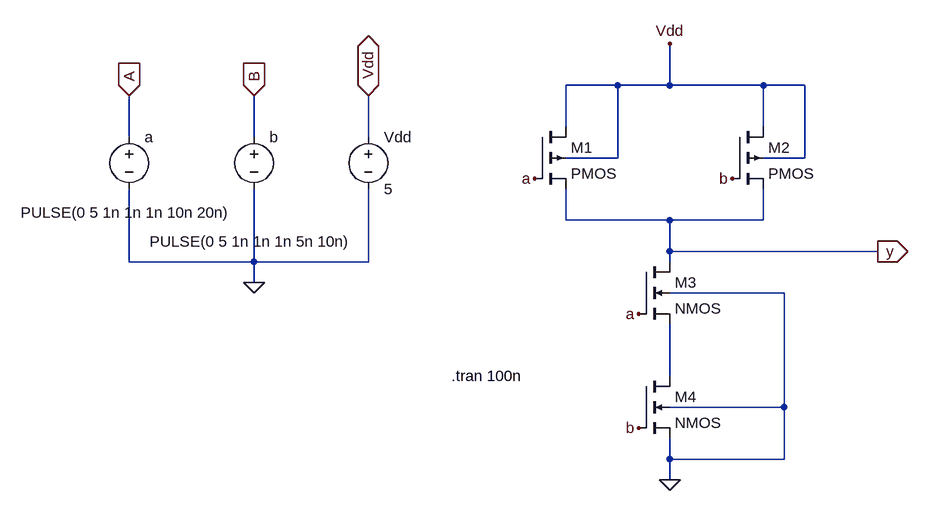
[diagram p0: schematic NAND.asc]
NAND.asc, the LTspice schematic file:
Version 4
SHEET 1 880 768
WIRE 368 144 288 144
WIRE 448 144 448 80
WIRE 448 144 368 144
WIRE 592 144 448 144
WIRE 656 144 592 144
WIRE 288 208 288 144
WIRE 592 208 592 144
WIRE -384 224 -384 160
WIRE -192 224 -192 160
WIRE -16 224 -16 160
WIRE 368 256 368 144
WIRE 368 256 288 256
WIRE 656 256 656 144
WIRE 656 256 592 256
WIRE 288 352 288 304
WIRE 448 352 288 352
WIRE 592 352 592 304
WIRE 592 352 448 352
WIRE 448 400 448 352
WIRE 768 400 448 400
WIRE -384 416 -384 304
WIRE -192 416 -192 304
WIRE -192 416 -384 416
WIRE -16 416 -16 304
WIRE -16 416 -192 416
WIRE 448 416 448 400
WIRE -192 448 -192 416
WIRE 624 464 448 464
WIRE 448 592 448 512
WIRE 624 640 624 464
WIRE 624 640 448 640
WIRE 448 720 448 688
WIRE 624 720 624 640
WIRE 624 720 448 720
WIRE 448 752 448 720
FLAG -192 448 0
FLAG -384 160 A
IOPIN -384 160 In
FLAG -192 160 B
IOPIN -192 160 In
FLAG -16 160 Vdd
IOPIN -16 160 BiDir
FLAG 448 752 0
FLAG 240 288 a
FLAG 400 496 a
FLAG 544 288 b
FLAG 400 672 b
FLAG 448 80 Vdd
FLAG 768 400 y
IOPIN 768 400 Out
SYMBOL pmos4 240 208 R0
SYMATTR InstName M1
SYMBOL pmos4 544 208 R0
SYMATTR InstName M2
SYMBOL nmos4 400 416 R0
SYMATTR InstName M3
SYMBOL nmos4 400 592 R0
SYMATTR InstName M4
SYMBOL Voltage -384 208 R0
WINDOW 3 -167 132 Left 2
SYMATTR InstName a
SYMATTR Value PULSE(0 5 1n 1n 1n 10n 20n)
SYMBOL Voltage -192 208 R0
WINDOW 3 -5 161 Top 2
SYMATTR InstName b
SYMATTR Value PULSE(0 5 1n 1n 1n 5n 10n)
SYMBOL Voltage -16 208 R0
SYMATTR InstName Vdd
SYMATTR Value 5
TEXT 112 592 Left 2 !.tran 100n

The netlist it stands for:
* NAND.asc
M1 Vdd A y Vdd PMOS
M2 Vdd B y Vdd PMOS
M3 y A N001 0 NMOS
M4 N001 B 0 0 NMOS
V§a A 0 PULSE(0 5 1n 1n 1n 10n 20n)
V§b B 0 PULSE(0 5 1n 1n 1n 5n 10n)
Vdd Vdd 0 5
.model NMOS NMOS
.model PMOS PMOS
.lib standard.mos
.tran 100n
.backanno
.end